# EAGLE design PCEmon_PLUS_rev_C (EAGLE 9.4.0)
PC Engine Joypad Breakout Version 1.0
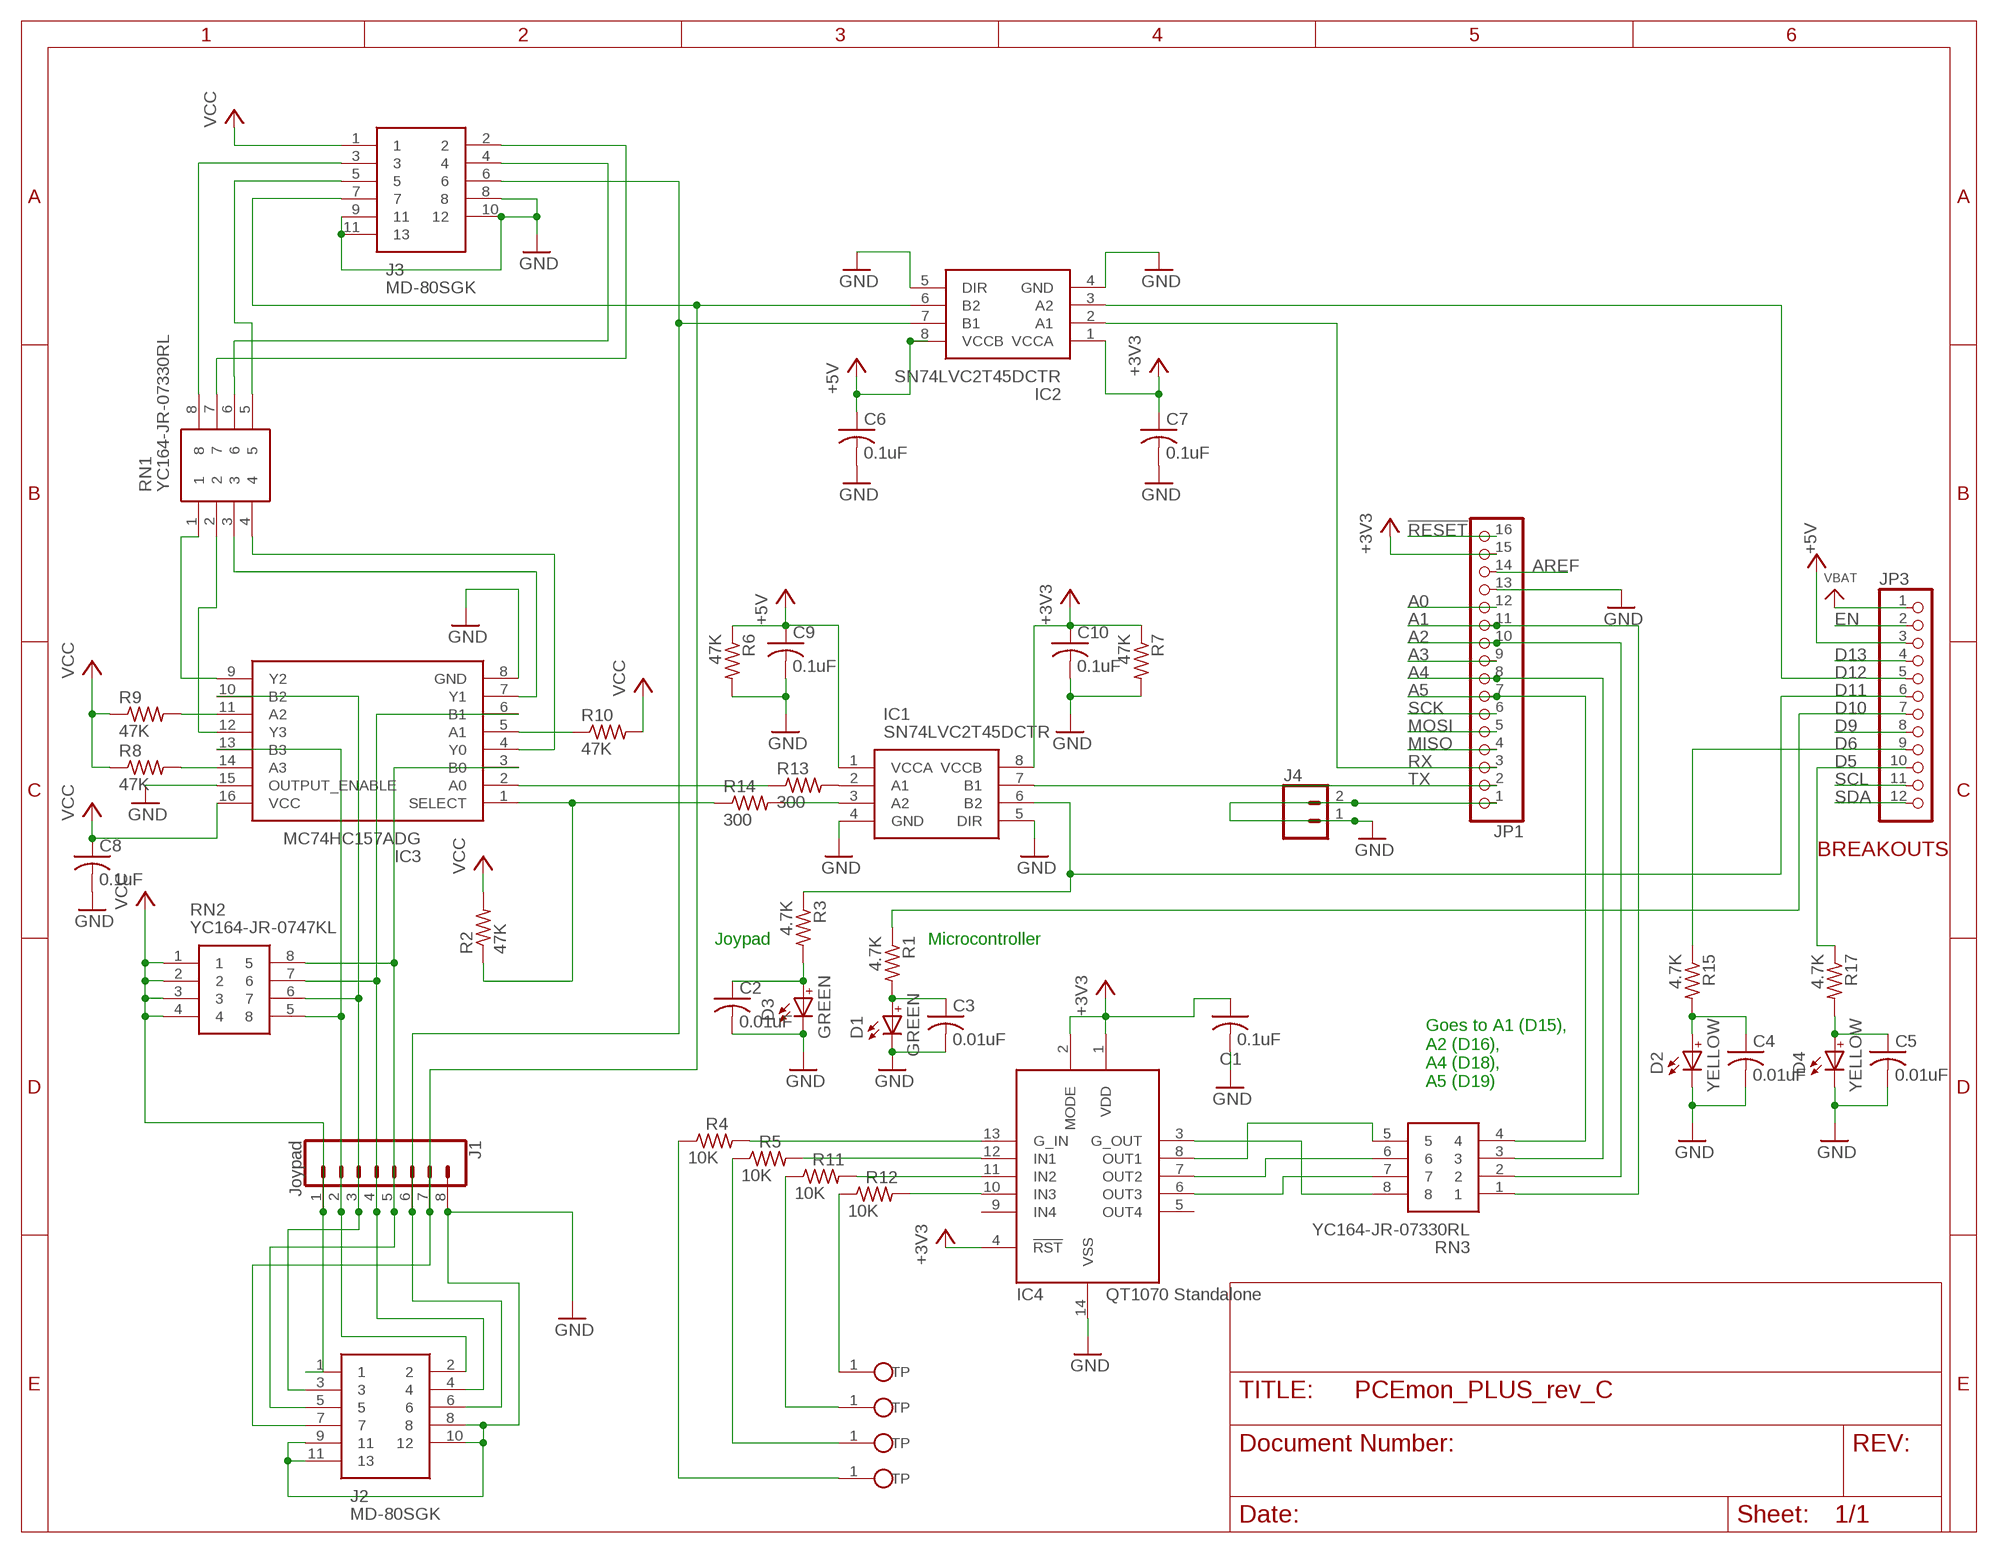
[diagram p0: schematic, sheet 1]

## Parts
C1  0.1uF  C-USC0603  [C0603]
C2  0.01uF  C-USC0603  [C0603]
C3  0.01uF  C-USC0603  [C0603]
C4  0.01uF  C-USC0603  [C0603]
C5  0.01uF  C-USC0603  [C0603]
C6  0.1uF  C-USC0603  [C0603]
C7  0.1uF  C-USC0603  [C0603]
C8  0.1uF  C-USC0603  [C0603]
C9  0.1uF  C-USC0603  [C0603]
C10  0.1uF  C-USC0603  [C0603]
D1  GREEN  WL-SMCC_0603_R/V/Y_150060RS73220  [WL-SMCC_0603_R/Y/V]
D2  YELLOW  WL-SMCC_0603_R/V/Y_150060RS73220  [WL-SMCC_0603_R/Y/V]
D3  GREEN  WL-SMCC_0603_R/V/Y_150060RS73220  [WL-SMCC_0603_R/Y/V]
D4  YELLOW  WL-SMCC_0603_R/V/Y_150060RS73220  [WL-SMCC_0603_R/Y/V]
IC1  SN74LVC2T45DCTR  [SOP65P400X130-8N]
IC2  SN74LVC2T45DCTR  [SOP65P400X130-8N]
IC3  MC74HC157ADG  [SOIC127P600X175-16N]
IC4  AT42QT1070-SSU  [SO14]
J1  Joypad  CONN_08"  [1X08]
J2  MD-80SGK  [MD80SGK]
J3  MD-80SGK  [MD80SGK]
J4  CONN_021X02_NO_SILK  [1X02_NO_SILK]
JP1  HEADER-1X16ROUND  [1X16_ROUND]
JP3  HEADER-1X12  [1X12_ROUND]
P1  JOYPAD  TOUCHPAD-350X500  [TOUCH-350X500]
P2  COMPUTER  TOUCHPAD-350X500  [TOUCH-350X500]
P3  Original Mode  TOUCHPAD-350X500  [TOUCH-350X500]
P4  PLUS Mode  TOUCHPAD-350X500  [TOUCH-350X500]
R1  4.7K  R-US_R0603  [R0603]
R2  47K  R-US_R0603  [R0603]
R3  4.7K  R-US_R0603  [R0603]
R4  10K  R-US_R0603  [R0603]
R5  10K  R-US_R0603  [R0603]
R6  47K  R-US_R0603  [R0603]
R7  47K  R-US_R0603  [R0603]
R8  47K  R-US_R0603  [R0603]
R9  47K  R-US_R0603  [R0603]
R10  47K  R-US_R0603  [R0603]
R11  10K  R-US_R0603  [R0603]
R12  10K  R-US_R0603  [R0603]
R13  300  R-US_R0603  [R0603]
R14  300  R-US_R0603  [R0603]
R15  4.7K  R-US_R0603  [R0603]
R17  4.7K  R-US_R0603  [R0603]
RN1  YC164-JR-07330RL  [YC164JR07220RL]
RN2  YC164-JR-0747KL  [YC164JR07220RL]
RN3  YC164-JR-07330RL  [YC164JR07220RL]

## Nets
!RESET: JP1.16
+3V3 [power]: C1.1 C7.1 C10.1 IC1.8(VCCB) IC2.1(VCCA) IC4.1(VDD) IC4.2(MODE) IC4.4(!RST) JP1.15 R7.1
+5V [power]: C6.1 C9.1 IC1.1(VCCA) IC2.8(VCCB) JP3.3 R6.1
A0: JP1.12
A1: JP1.11 RN3.1
A2: JP1.10 RN3.2
A3: JP1.9
A4: JP1.8 RN3.3
A5: JP1.7 RN3.4
AREF: JP1.14
D5 [signal]: JP3.10 R17.1
D6 [signal]: JP3.9 R15.1
D9: JP3.8
D10 [signal]: JP3.7 R1.1
D11 [signal]: IC1.6(B2) JP3.6 R3.1
D12 [signal]: IC2.3(A2) JP3.5
D13 [signal]: JP3.4
EN: JP3.2
GND: C1.2 C2.2 C3.2 C4.2 C5.2 C6.2 C7.2 C8.2 C9.2 C10.2 D1.1(C) D2.1(C) D3.1(C) D4.1(C) IC1.4(GND) IC1.5(DIR) IC2.4(GND) IC2.5(DIR) IC3.8(GND) IC3.15(OUTPUT_ENABLE) IC4.14(VSS) J1.8 J2.8 J2.9 J2.10 J2.11 J3.8 J3.9 J3.10 J3.11 J4.1 J4.2 JP1.1 JP1.13 R6.2 R7.2
MISO: JP1.4
MOSI: JP1.5
N$1: C2.1 D3.2(A) R3.2
N$2 [signal]: IC3.10(B2) J1.3 J2.3 RN2.6
N$3 [signal]: IC3.13(B3) J1.2 J2.2 RN2.5
N$4 [signal]: IC3.6(B1) J1.4 J2.4 RN2.7
N$5 [signal]: IC3.3(B0) J1.5 J2.5 RN2.8
N$6 [signal]: IC2.7(B1) J1.6 J2.6 J3.6
N$7 [signal]: IC2.6(B2) J1.7 J2.7 J3.7
N$8: J3.5 RN1.5
N$9: C3.1 D1.2(A) R1.2
N$10: J3.4 RN1.6
N$11: J3.3 RN1.8
N$12: IC3.14(A3) R8.2
N$13: IC3.11(A2) R9.2
N$14: IC3.1(SELECT) R2.1 R14.1
N$15: IC1.2(A1) R13.2
N$16: IC3.5(A1) R10.1
N$17: IC3.9(Y2) RN1.1
N$18: IC3.2(A0) R13.1
N$19: IC1.3(A2) R14.2
N$20: IC3.12(Y3) RN1.2
N$21: IC4.13(G_IN) R4.2
N$22: IC3.4(Y0) RN1.4
N$23: J3.2 RN1.7
N$24: IC3.7(Y1) RN1.3
N$25: IC4.12(IN1) R5.2
N$26: IC4.11(IN2) R11.2
N$27: IC4.10(IN3) R12.2
N$28: IC4.3(G_OUT) RN3.8
N$29: IC4.6(OUT3) RN3.7
N$30: IC4.7(OUT2) RN3.6
N$31: IC4.8(OUT1) RN3.5
N$32: P3.1(TP) R5.1
N$33: P4.1(TP) R4.1
N$34: P2.1(TP) R11.1
N$35: P1.1(TP) R12.1
N$36: C4.1 D2.2(A) R15.2
N$38: C5.1 D4.2(A) R17.2
RX: IC2.2(A1) JP1.3
SCK: JP1.6
SCL: JP3.11
SDA: JP3.12
TX: IC1.7(B1) JP1.2
VBAT: JP3.1
VCC [power]: C8.1 IC3.16(VCC) J1.1 J2.1 J3.1 R2.2 R8.1 R9.1 R10.2 RN2.1 RN2.2 RN2.3 RN2.4
Unconnected: IC4.5(OUT4) IC4.9(IN4)

## Notes on the sheet
- BREAKOUTS
- Joypad | Microcontroller
- Goes to A1 (D15),
  A2 (D16),
  A4 (D18),
  A5 (D19)

## Library data of the parts
C1-C10 = resistor:C-US: CAPACITOR, American symbol
D1-D4 = Wurth_Elektronik_Optoelectronics_rev19a:WL-SMCC_0603_R/V/Y: WL-SMCC SMD Mono-color Chip LED Compact Characteristics Compatible to IR reflow soldering Miniaturized color effect Size 0603 Industrial platform – 1.6 x 0.8 mm Ultra thin 0.2 mm PCB based Temperature Tj = 115°C / 125°C Applications Size 0603 Office Automation Home appliances Industrial equipment Industrial switches and button backlighting Dashboards Entertainment consoles Small pixel indoor signs <http://katalog.we-online.de/media/images/v2/Family_WL-SMCC_neu.jpg> Details see: http://katalog.we-online.de/en/led/WL-SMCC?m Created By Yingchun Shan 2018-03-09 2018 (C) Wurth Elektronik
IC1 IC2 = SamacSys_Parts:SN74LVC2T45DCTR: 2-Bit Bus Transceiver, Translation SSOP8 SN74LVC2T45DCTR, Voltage Level Translator, Bus Transceiver LVC, 3-State 1.65 Source: Datasheet <http://www.ti.com/lit/ds/symlink/sn74lvc2t45.pdf>; DESCRIPTION: 2-Bit Bus Transceiver, Translation SSOP8 SN74LVC2T45DCTR, Voltage Level Translator, Bus Transceiver LVC, 3-State 1.65; HEIGHT: 1.3mm; MANUFACTURER_NAME: Texas Instruments; MANUFACTURER_PART_NUMBER: SN74LVC2T45DCTR; MOUSER_PART_NUMBER: 595-SN74LVC2T45DCTR; MOUSER_PRICE-STOCK: https://www.mouser.com/Search/Refine.aspx?Keyword=595-SN74LVC2T45DCTR; RS_PART_NUMBER: 9213022; RS_PRICE-STOCK: http://uk.rs-online.com/web/p/products/9213022
IC3 = PC-Engine:MC74HC157ADG: Source: Datasheet <http://www.onsemi.com/pub/Collateral/MC74HC157A-D.PDF>; ALLIED_NUMBER: 70466365; ALLIED_PRICE-STOCK: http://www.alliedelec.com/on-semiconductor-mc74hc157adg/70466365/; HEIGHT: 1.75mm; MANUFACTURER_NAME: ON Semiconductor; MANUFACTURER_PART_NUMBER: MC74HC157ADG; MOUSER_PART_NUMBER: 863-MC74HC157ADG; MOUSER_PRICE-STOCK: https://www.mouser.com/Search/Refine.aspx?Keyword=863-MC74HC157ADG; RS_PART_NUMBER: 8061422P; RS_PRICE-STOCK: http://uk.rs-online.com/web/p/products/8061422P
IC4 = adafruit:AT42QT1070: QTouch 5-channel standalone sensor IC AT42QT1070 in standalone mode has 5 inputs (guard + 4 key) and open drain outputs. 1.8V-5.5V power.
J1 = SparkFun-Connectors:CONN_08: Multi connection point. Often used as Generic Header-pin footprint for 0.1 inch spaced/style header connections On any of the 0.1 inch spaced packages, you can populate with these: Break Away Headers - Straight <https://www.sparkfun.com/products/116> (PRT-00116) Break Away Male Headers - Right Angle <https://www.sparkfun.com/products/553> (PRT-00553) Female Headers <https://www.sparkfun.com/products/115> (PRT-00115) Break Away Headers - Machine Pin <https://www.sparkfun.com/products/117> (PRT-00117) Break Away Female Headers - Swiss Machine Pin <https://www.sparkfun.com/products/743> (PRT-00743) Arduino Stackable Header - 8 Pin <https://www.sparkfun.com/products/9279> (PRT-09279) For SCREWTERMINALS and SPRING TERMINALS visit here: Screw Terimnals on SparkFun.com <https://www.sparkfun.com/search/results?term=Screw+Terminals> (5mm/3.5mm/2.54mm spacing) This device is also useful as a general connection point to wire up your design to another part of your project. Our various solder wires solder well into these plated through hole pads. Hook-Up Wire - Assortment (Stranded, 22 AWG) <https://www.sparkfun.com/products/11375> (PRT-11375) Hook-Up Wire - Assortment (Solid Core, 22 AWG) <https://www.sparkfun.com/products/11367> (PRT-11367) View the entire wire category on our website here <https://www.sparkfun.com/categories/141> Special notes: Molex polarized connector foot print use with SKU : PRT-08231 with associated crimp pins and housings. 1MM SMD Version SKU: PRT-10208 NOTES ON THE VARIANTS LOCK and LOCK_LONGPADS... This footprint was designed to help hold the alignment of a through-hole component (i.e. 6-pin header) while soldering it into place. You may notice that each hole has been shifted either up or down by 0.005 of an inch from it's more standard position (which is a perfectly straight line). This slight alteration caused the pins (the squares in the middle) to touch the edges of the holes. Because they are alternating, it causes a "brace" to hold the component in place. 0.005 has proven to be the perfect amount of "off-center" position when using our standard breakaway headers. Although looks a little odd when you look at the bare footprint, once you have a header in there, the alteration is very hard to notice. Also,if you push a header all the way into place, it is covered up entirely on the bottom side.; PROD_ID: CONN-08438
J2 J3 = SamacSys_Parts:MD-80SGK: Circular DIN Connectors mini-DIN, 8P jack, rt, through hole, full shield Source: Datasheet <https://www.cui.com/product/resource/md-sgk-series.pdf>; DESCRIPTION: Circular DIN Connectors mini-DIN, 8P jack, rt, through hole, full shield; HEIGHT: 13mm; MANUFACTURER_NAME: CUI; MANUFACTURER_PART_NUMBER: MD-80SGK; MOUSER_PART_NUMBER: 490-MD-80SGK; MOUSER_PRICE-STOCK: https://www.mouser.com/Search/Refine.aspx?Keyword=490-MD-80SGK
J4 = SparkFun-Connectors:CONN_02: Multi connection point. Often used as Generic Header-pin footprint for 0.1 inch spaced/style header connections On any of the 0.1 inch spaced packages, you can populate with these: Break Away Headers - Straight <https://www.sparkfun.com/products/116> (PRT-00116) Break Away Male Headers - Right Angle <https://www.sparkfun.com/products/553> (PRT-00553) Female Headers <https://www.sparkfun.com/products/115> (PRT-00115) Break Away Headers - Machine Pin <https://www.sparkfun.com/products/117> (PRT-00117) Break Away Female Headers - Swiss Machine Pin <https://www.sparkfun.com/products/743> (PRT-00743) For SCREWTERMINALS and SPRING TERMINALS visit here: Screw Terimnals on SparkFun.com <https://www.sparkfun.com/search/results?term=Screw+Terminals> (5mm/3.5mm/2.54mm spacing) This device is also useful as a general connection point to wire up your design to another part of your project. Our various solder wires solder well into these plated through hole pads. Hook-Up Wire - Assortment (Stranded, 22 AWG) <https://www.sparkfun.com/products/11375> (PRT-11375) Hook-Up Wire - Assortment (Solid Core, 22 AWG) <https://www.sparkfun.com/products/11367> (PRT-11367) View the entire wire category on our website here <https://www.sparkfun.com/categories/141> Special notes: Molex polarized connector foot print use with: PRT-08233 with associated crimp pins and housings. 2.54_SCREWTERM for use with PRT-10571. 3.5mm Screw Terminal footprints for PRT-08084 5mm Screw Terminal footprints for use with PRT-08432
JP1 = microbuilder:HEADER-1X16: PIN HEADER
JP3 = microbuilder:HEADER-1X12
P1-P4 = SamacSys_Parts:TOUCHPAD-350X500
R1-R15 R17 = resistor:R-US_: RESISTOR, American symbol
RN1 RN3 = SamacSys_Parts:YC164-JR-07330RL: YAGEO - YC164-JR-07330RL - RESISTOR ARRAY, ARV241 1206 330R Source: Datasheet <https://media.digikey.com/pdf/Data Sheets/Yageo PDFs/YC102-358,TC122-164_Series_DS.pdf>; DESCRIPTION: YAGEO - YC164-JR-07330RL - RESISTOR ARRAY, ARV241 1206 330R; HEIGHT: 0mm; MANUFACTURER_NAME: YAGEO (PHYCOMP); MANUFACTURER_PART_NUMBER: YC164-JR-07330RL; MOUSER_PART_NUMBER: 603-YC164-JR-07330RL; MOUSER_PRICE-STOCK: https://www.mouser.com/Search/Refine.aspx?Keyword=603-YC164-JR-07330RL
RN2 = SamacSys_Parts:YC164-JR-0747KL: YAGEO - YC164-JR-0747KL - RESISTOR ARRAY, ARV241 1206 47K Source: Datasheet <https://media.digikey.com/pdf/Data Sheets/Yageo PDFs/YC102-358,TC122-164_Series_DS.pdf>; DESCRIPTION: YAGEO - YC164-JR-0747KL - RESISTOR ARRAY, ARV241 1206 47K; HEIGHT: 0mm; MANUFACTURER_NAME: YAGEO (PHYCOMP); MANUFACTURER_PART_NUMBER: YC164-JR-0747KL; MOUSER_PART_NUMBER: 603-YC164-JR-0747KL; MOUSER_PRICE-STOCK: https://www.mouser.com/Search/Refine.aspx?Keyword=603-YC164-JR-0747KL

## Net classes
0 default: width 0.152 mm, drill 0.356 mm, clearance 0.152 mm
1 power: width 0.305 mm, drill 0.356 mm, clearance 0.152 mm
2 signal: width 0.152 mm, drill 0.356 mm, clearance 0.152 mm

## Board
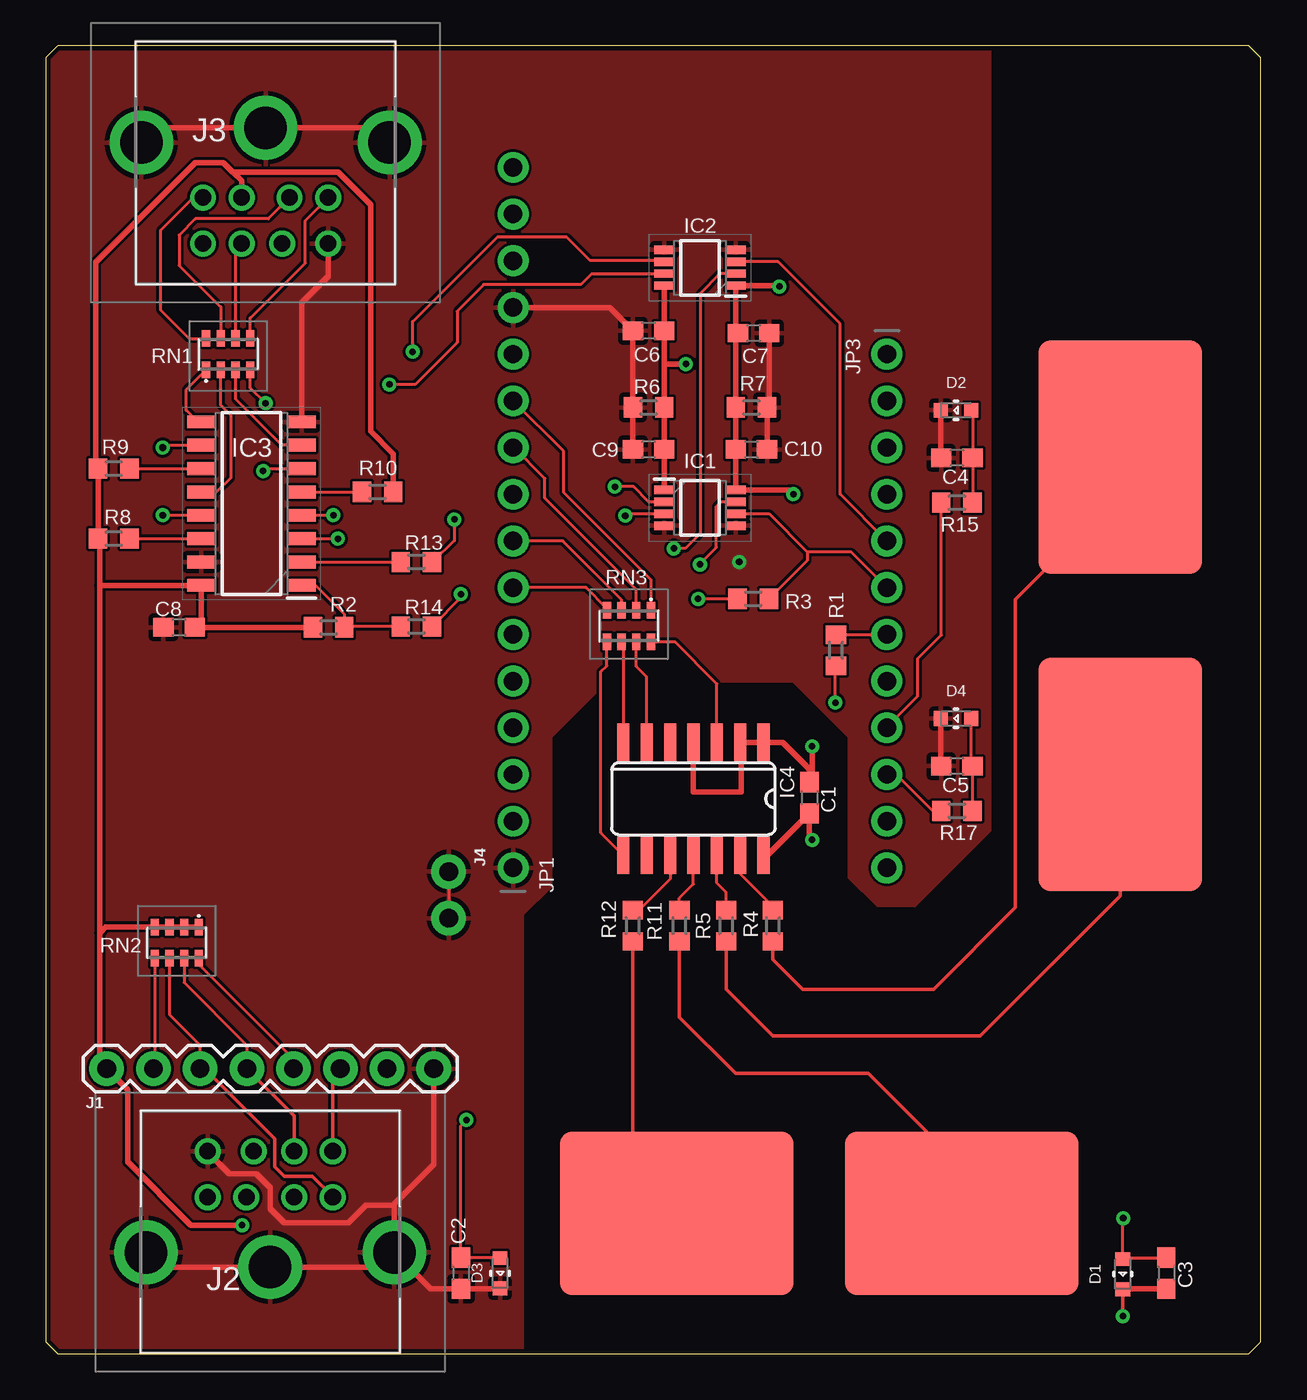
[diagram p1: board, top side]
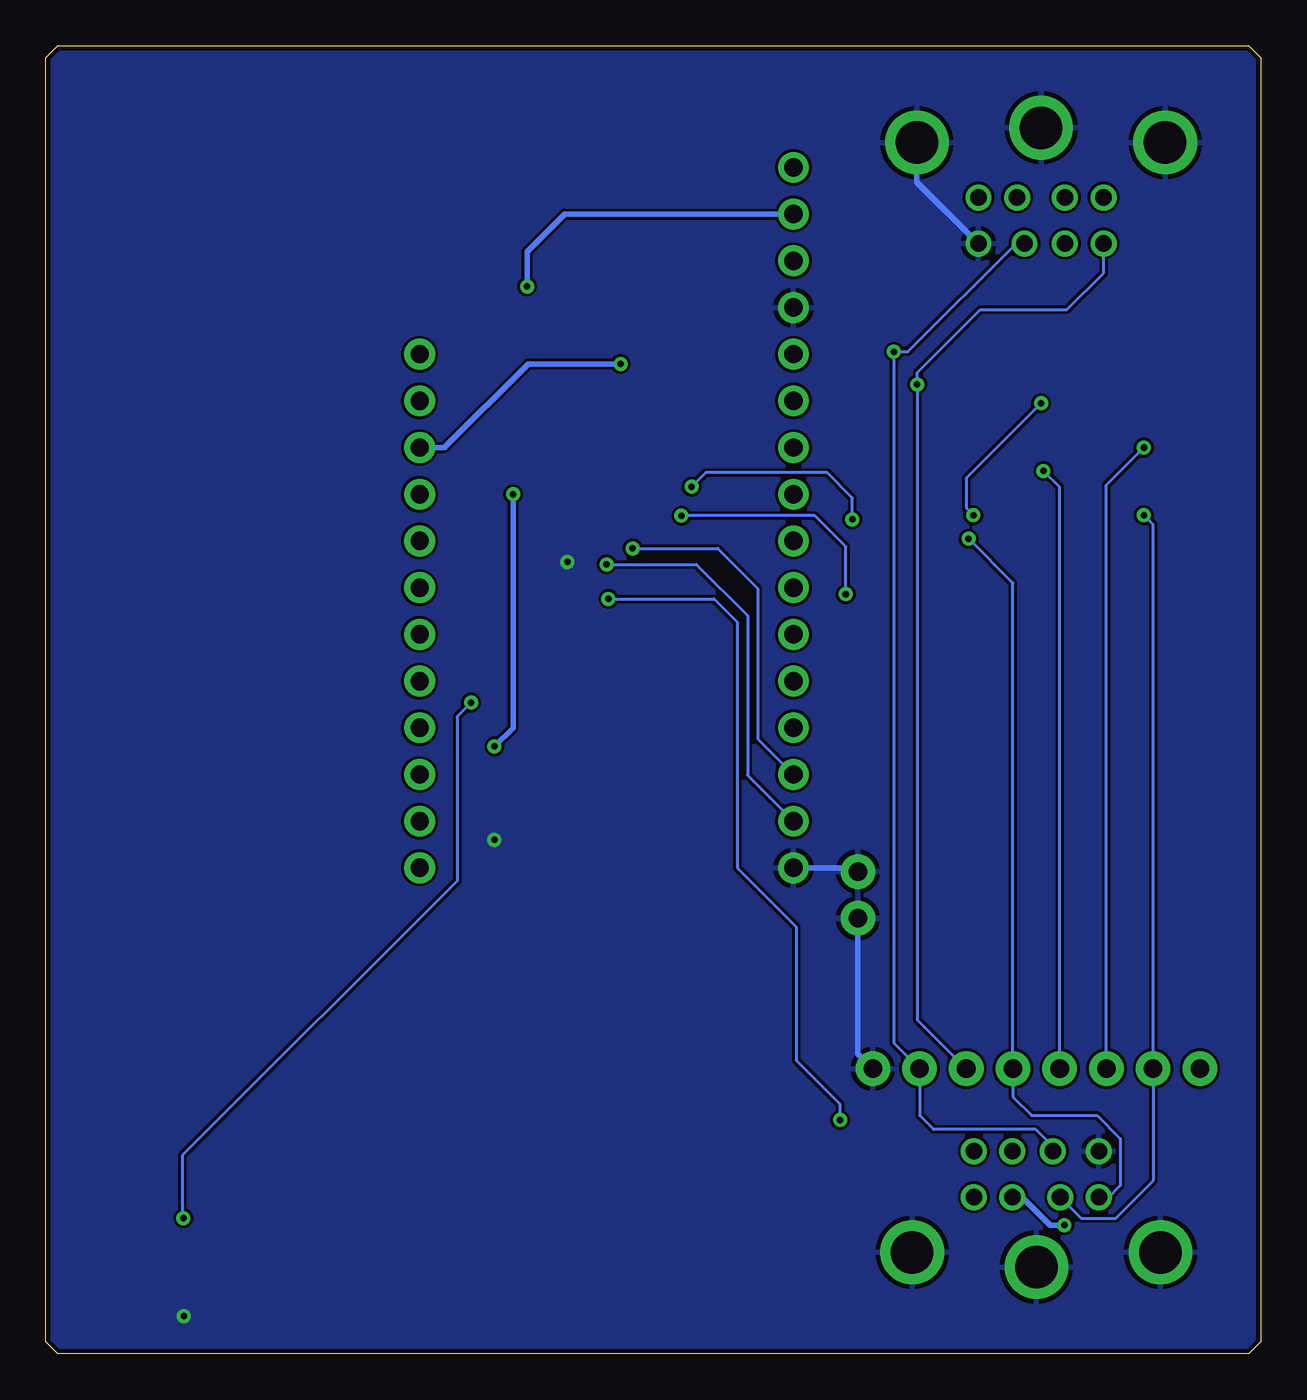
[diagram p2: board, bottom side, seen from below]

Size 66.04 x 71.12 mm. Coordinates in mm from the lower left corner, seen from the top.
Outline: 0.64,0 65.41,0 66.04,0.64 66.04,70.48 65.41,71.12 0.64,71.12 0,70.48 0,0.64 0.64,0
Copper layers (1*16): Top 0.035mm / dielectric 1.5mm / Bottom 0.035mm
Design rules "default *": minimum track width 6mil, minimum drill 0.35mm, track to track 6mil, track to pad 6mil, pad to pad 6mil, via to via 6mil, smd to smd 6mil, copper to edge 10mil, drill to drill 6mil, minimum pad ring 10mil, minimum via ring 8mil, stop-mask expansion 6mil, vias tented up to drill 15mil, thermal gap 10mil

### Footprints (pad centres in the part's own frame; a part is rotated, then mirrored left to right if it is on the bottom)
C0603 = smd 1.1 x 1: 1 -0.85,0; 2 0.85,0
WL-SMCC_0603_R/Y/V = smd 0.75 x 0.8: 1 -0.825,0; 2 0.825,0
SOP65P400X130-8N = smd 1.1 x 0.45: 1 -1.95,0.975; 2 -1.95,0.325; 3 -1.95,-0.325; 4 -1.95,-0.975; 5 1.95,-0.975; 6 1.95,-0.325; 7 1.95,0.325; 8 1.95,0.975
SOIC127P600X175-16N = smd 1.55 x 0.7: 1 -2.725,4.445; 2 -2.725,3.175; 3 -2.725,1.905; 4 -2.725,0.635; 5 -2.725,-0.635; 6 -2.725,-1.905; 7 -2.725,-3.175; 8 -2.725,-4.445; 9 2.725,-4.445; 10 2.725,-3.175; 11 2.725,-1.905; 12 2.725,-0.635; 13 2.725,0.635; 14 2.725,1.905; 15 2.725,3.175; 16 2.725,4.445
SO14 = smd 0.66 x 2.032: 1 -3.81,-3.073; 2 -2.54,-3.073; 3 -1.27,-3.073; 4 0,-3.073; 5 1.27,-3.073; 6 2.54,-3.073; 7 3.81,-3.073; 8 3.81,3.073; 9 2.54,3.073; 10 1.27,3.073; 11 0,3.073; 12 -1.27,3.073; 13 -2.54,3.073; 14 -3.81,3.073
1X08 = drill 1.016 pad 1.88: 1 0,0; 2 2.54,0; 3 5.08,0; 4 7.62,0; 5 10.16,0; 6 12.7,0; 7 15.24,0; 8 17.78,0
MD80SGK = drill 0.9 pad 1.4: 1 -1.3,-1.9; 2 1.3,-1.9; 3 -3.4,-1.9; 4 -1.3,-4.4; 5 3.4,-1.9; 6 -3.4,-4.4; 7 0.9,-4.4; 8 3.4,-4.4 | drill 2.309 pad 3.463: 9 0,1.9; 10 -6.75,1.1; 11 6.75,1.1
1X02_NO_SILK = drill 1.016 pad 1.88: 1 0,0; 2 2.54,0
1X16_ROUND = drill 1 pad 1.676: 1 -19.05,0; 2 -16.51,0; 3 -13.97,0; 4 -11.43,0; 5 -8.89,0; 6 -6.35,0; 7 -3.81,0; 8 -1.27,0; 9 1.27,0; 10 3.81,0; 11 6.35,0; 12 8.89,0; 13 11.43,0; 14 13.97,0; 15 16.51,0; 16 19.05,0
1X12_ROUND = drill 1 pad 1.676: 1 -13.97,0; 2 -11.43,0; 3 -8.89,0; 4 -6.35,0; 5 -3.81,0; 6 -1.27,0; 7 1.27,0; 8 3.81,0; 9 6.35,0; 10 8.89,0; 11 11.43,0; 12 13.97,0
TOUCH-350X500 = smd 12.7 x 8.89: 1 0,0
R0603 = smd 1 x 1.1: 1 -0.85,0; 2 0.85,0
YC164JR07220RL = smd 0.45 x 0.9: 1 -1.2,-0.85; 2 -0.4,-0.85; 3 0.4,-0.85; 4 1.2,-0.85; 5 1.2,0.85; 6 0.4,0.85; 7 -0.4,0.85; 8 -1.2,0.85

### Placement (x,y rotation side)
C1  41.5,30.23 270 top
C2  22.56,4.37 270 top
C3  60.91,4.37 270 top
C4  49.53,48.72 180 top
C5  49.53,31.95 180 top
C6  32.77,55.63 180 top
C7  38.48,55.5 0 top
C8  7.24,39.5 180 top
C9  32.77,49.17 180 top
C10  38.35,49.17 0 top
D1  58.55,4.32 90 top
D2  49.48,51.31 0 top
D3  24.69,4.37 90 top
D4  49.48,34.54 0 top
IC1  35.56,46 0 top
IC2  35.56,59.05 180 top
IC3  11.18,46.23 180 top
IC4  35.2,30.18 180 top
J1  3.3,15.49 0 top
J2  12.19,6.6 180 top
J3  11.94,64.77 0 top
J4  21.89,26.21 270 top
JP1  25.4,45.47 90 top
JP3  45.72,40.39 270 top
P1  34.29,7.62 0 top
P2  49.78,7.62 0 top
P3  58.42,31.5 90 top
P4  58.42,48.77 90 top
R1  42.95,38.25 270 top
R2  15.37,39.5 180 top
R3  38.46,41.05 180 top
R4  39.52,23.27 90 top
R5  36.98,23.27 90 top
R6  32.77,51.46 180 top
R7  38.35,51.46 0 top
R8  3.68,44.32 0 top
R9  3.68,48.13 0 top
R10  18.03,46.86 0 top
R11  34.44,23.27 90 top
R12  31.9,23.27 90 top
R13  20.14,43.05 0 top
R14  20.14,39.55 0 top
R15  49.53,46.28 0 top
R17  49.53,29.51 0 top
RN1  9.91,54.36 0 top
RN2  7.11,22.35 180 top
RN3  31.7,39.57 180 top

### Tracks (layer width: path | path; a pad name or v marks a point on that pad's centre or on a via)
+3V3  (via drill 0.36)
  Top 0.305: v39.88,58.04 39.84,58.08 IC2.1 37.51,55.62 C7.1 37.5,55.37 R7.1 C10.1 IC1.8 40.4,46.97 v40.64,46.74 | IC4.4 35.2,30.53 37.8,30.53 37.8,33.2 IC4.2 IC4.1 40.06,33.25 41.5,31.8 C1.1 41.66,31.23 v41.66,33.02
  Bottom 0.305: JP1.15 37.85,61.98 39.88,59.94 v39.88,58.04 | v41.66,33.02 40.64,34.04 v40.64,46.74
+5V  (via drill 0.36)
  Top 0.305: IC1.1 C9.1 R6.1 33.62,53.82 | 33.62,53.82 C6.1 IC2.8 | v34.8,53.82 33.62,53.82
  Bottom 0.305: JP3.3 44.37,49.28 39.83,53.82 v34.8,53.82
A1
  Top 0.152: JP1.11 28.14,49.07 28.14,46.84 32.9,42.08 RN3.1
A2
  Top 0.152: JP1.10 25.45,49.28 27.13,47.6 27.13,46.53 32.1,41.56 RN3.2
A4
  Top 0.152: RN3.3 31.3,41 28.1,44.2 JP1.8
A5
  Top 0.152: RN3.4 30.5,40.52 29.36,41.66 JP1.7
D5
  Top 0.152: R17.1 48.21,29.52 46.23,31.5 JP3.10
D6
  Top 0.152: R15.1 48.68,39.08 47.4,37.8 47.4,35.76 45.72,34.09 JP3.9
D10
  Top 0.152: R1.1 45.25,39.1 45.26,39.12 JP3.7
D11
  Top 0.152: IC1.6 39.31,45.67 41.4,43.59 | JP3.6 43.79,43.59 41.4,43.59 | 41.4,43.59 41.4,43.14 R3.1
D12
  Top 0.152: IC2.3 39.81,59.38 43.18,56.01 43.18,46.74 JP3.5
GND  (via drill 0.36)
  Top 0.152: J4.1 J4.2
  Top 0.203: v58.55,2.03 D1.1
  Top 0.305: 18.86,8.06 18.92,8.06 18.92,5.52 J2.10 | 18.86,8.06 17.4,8.06 16.45,7.11 12.95,7.11 12.19,7.87 12.19,9.02 11.43,9.78 9.97,9.78 9.02,10.73 J2.8 | C10.2 R7.2 39.33,51.59 C7.2 | C9.2 R6.2 C6.2 30.65,56.9 JP1.13 | J2.11 6.24,4.7 J2.9 18.14,4.7 J2.10 | J1.8 21.08,10.29 18.86,8.06 | J3.10 5.99,66.67 J3.9 17.89,66.67 J3.11 | IC3.8 13.9,57.16 15.34,58.6 J3.8 | IC4.14 39.23,27.1 C1.2 41.5,28.09 v41.66,27.94 | J2.10 20.93,3.52 C2.2 24.66,3.52 D3.1 | D1.1 58.57,3.52 C3.2 | C5.2 48.65,31.98 D4.1 | C4.2 48.65,48.74 D2.1
  Bottom 0.305: J3.8 18.69,63.72 J3.11 | J4.2 21.89,16.31 J1.8 | J4.1 22.1,26.42 JP1.1
  other vias: 37.69,43.05
  pour Bottom: -0.38,71.88 67.06,71.88 67.06,-0.38 -0.38,-0.38
  pour Top: -0.51,-0.51 -0.51,71.63 51.31,71.63 51.31,28.45 47.24,24.38 45.21,24.38 43.69,25.91 43.69,33.53 40.64,36.58 30.48,36.58 27.43,33.53 27.43,25.4 25.91,23.88 25.91,-0.51
N$1  (via drill 0.36)
  Top 0.152: R3.2 v35.46,41.05 | D3.2 22.58,5.19 C2.1 22.55,12.39 v22.86,12.7
  Bottom 0.152: v35.46,41.05 29.72,41.05 28.45,39.78 28.45,26.42 25.25,23.22 25.25,15.95 22.86,13.56 v22.86,12.7
N$2  (via drill 0.36)
  Top 0.152: v6.35,49.28 6.48,49.4 IC3.10 | RN2.6 6.71,18.43 8.38,16.76 J1.3
  Top 0.203: J1.3 8.64,15.49 12.45,11.68 12.45,10.16 12.95,9.65 14.48,9.65 15.59,8.54 J2.3
  Bottom 0.152: J1.3 8.38,47.24 v6.35,49.28
N$3  (via drill 0.36)
  Top 0.152: v6.35,45.59 IC3.13 | RN2.5 5.91,15.91 5.84,15.84 J1.2
  Bottom 0.152: J2.2 9.75,7.37 7.87,7.37 5.84,9.4 J1.2 5.84,45.09 v6.35,45.59
N$4  (via drill 0.36)
  Top 0.152: v11.81,48.01 11.94,48.13 IC3.6 | RN2.7 7.51,20.17 10.92,16.76 J1.4
  Top 0.203: J2.4 13.49,12.92 J1.4
  Bottom 0.152: J1.4 10.92,47.12 v11.81,48.01
N$5  (via drill 0.36)
  Top 0.152: IC3.3 v15.88,44.32 | RN2.8 8.31,21.15 13.46,16 J1.5
  Bottom 0.152: J2.5 8.26,8.5 7.62,9.14 7.62,11.68 8.89,12.95 12.45,12.95 13.46,13.97 J1.5 13.46,41.91 v15.88,44.32
N$6  (via drill 0.36)
  Top 0.152: IC2.7 29.67,58.73 29.08,58.14 23.8,58.14 22.35,56.69 22.35,54.99 20.07,52.7 v18.67,52.7
  Top 0.203: J2.6 15.59,15.08 J1.6
  Bottom 0.152: J1.6 18.67,18.16 v18.67,52.7 18.67,53.34 15.24,56.77 10.54,56.77 8.54,58.77 J3.6
N$7  (via drill 0.36)
  Top 0.152: IC2.6 33.54,59.45 29.59,59.45 28.32,60.72 24.52,60.72 19.94,56.13 v19.94,54.48
  Bottom 0.152: J2.7 11.29,11.26 12.23,12.19 17.78,12.19 18.54,12.95 J1.7 19.94,16.89 v19.94,54.48 19.18,54.48 13.29,60.37 J3.7
N$8
  Top 0.152: J3.5 14.1,61.63 14.1,59.31 11.11,56.32 RN1.5
N$9  (via drill 0.36)
  Top 0.152: v42.93,35.41 42.93,37.38 R1.2 | v58.57,7.37 58.55,7.34 D1.2 58.62,5.22 C3.1
  Bottom 0.152: v42.93,35.41 43.69,34.65 43.69,25.7 58.62,10.77 58.62,7.42 v58.57,7.37
N$10
  Top 0.152: RN1.6 10.31,60.04 J3.4
N$11
  Top 0.152: J3.3 8.01,62.87 6.22,61.09 6.22,56.77 7.79,55.21 RN1.8
N$12
  Top 0.152: R8.2 IC3.14
N$13
  Top 0.152: R9.2 IC3.11
N$14
  Top 0.152: IC3.1 14.66,41.78 16.22,40.23 R2.1 16.27,39.55 R14.1
N$15  (via drill 0.36)
  Top 0.152: v22.2,45.36 22.2,44.21 R13.2 | IC1.2 32.77,46.32 31.95,47.14 v30.94,47.14
  Bottom 0.152: v22.2,45.36 22.2,46.53 23.57,47.9 30.18,47.9 v30.94,47.14
N$16
  Top 0.152: IC3.5 R10.1
N$17
  Top 0.152: IC3.9 8.26,50.67 7.62,51.31 7.62,52.42 RN1.1
N$18
  Top 0.152: IC3.2 R13.1
N$19  (via drill 0.36)
  Top 0.152: v22.55,41.3 22.55,41.11 R14.2 | v31.5,45.57 31.6,45.67 IC1.3
  Bottom 0.152: v22.55,41.3 22.55,43.89 24.23,45.57 v31.5,45.57
N$20
  Top 0.152: IC3.12 9.27,46.86 10.03,47.62 10.03,51.05 9.51,51.58 RN1.2
N$21
  Top 0.152: R4.2 39.52,24.32 37.74,26.1 IC4.13
N$22  (via drill 0.36)
  Top 0.152: IC3.4 v15.62,45.59 | v11.94,51.69 11.11,52.52 RN1.4
  Bottom 0.152: v15.62,45.59 16,45.97 16,47.62 v11.94,51.69
N$23
  Top 0.152: J3.2 12.09,61.72 8.13,61.72 7.24,60.83 7.24,59.18 9.51,56.91 RN1.7
N$24
  Top 0.152: IC3.7 12.83,49.4 10.31,51.92 RN1.3
N$25
  Top 0.152: R5.2 36.98,25.08 36.47,25.59 IC4.12
N$26
  Top 0.152: R11.2 34.44,24.78 35.2,25.54 IC4.11
N$27
  Top 0.152: IC4.10 33.93,25.81 32.24,24.12 R12.2
N$28
  Top 0.152: IC4.3 36.47,36.42 34.17,38.72 RN3.8
N$29
  Top 0.152: IC4.6 32.66,36.8 32.1,37.37 RN3.7
N$30
  Top 0.152: RN3.6 31.39,38.63 IC4.7
N$31
  Top 0.152: IC4.8 30.18,28.32 30.18,37.08 30.5,37.41 RN3.5
N$32
  Top 0.203: R5.1 36.98,19.81 39.52,17.27 50.8,17.27 58.42,24.89 P3.1
N$33
  Top 0.203: P4.1 58.42,46.74 52.7,41.02 52.7,24.26 48.26,19.81 41.15,19.81 39.52,21.44 R4.1
N$34
  Top 0.203: R11.1 34.44,18.29 37.49,15.24 44.7,15.24 49.78,10.16 P2.1
N$35
  Top 0.203: R12.1 31.9,11.79 34.29,9.4 P1.1
N$36
  Top 0.152: D2.2 50.38,51.23 C4.1 R15.2
N$38
  Top 0.152: R17.2 C5.1 50.3,32.03 D4.2
RX  (via drill 0.36)
  Top 0.152: IC2.2 36.63,58.73 35.56,57.66 35.56,44.6 34.75,43.79 v34.14,43.79
  Bottom 0.152: v34.14,43.79 29.52,43.79 27.33,41.6 27.33,33.43 JP1.3
TX  (via drill 0.36)
  Top 0.152: IC1.7 36.7,46.32 36.45,46.08 36.45,43.84 35.55,42.94 v35.56,42.93
  Bottom 0.152: v35.56,42.93 30.68,42.93 27.89,40.13 27.89,31.45 JP1.2
VCC  (via drill 0.36)
  Top 0.305: v10.67,6.99 7.87,6.99 4.45,10.41 4.45,14.35 J1.1 2.92,15.88 2.92,22.86 | 2.92,41.78 2.92,22.86 | 2.92,41.78 IC3.16 8.45,39.86 C8.1 R2.2 | 10.16,64.26 10.64,63.78 J3.1 | 10.16,64.26 9.65,64.77 8.13,64.77 2.71,59.35 2.71,48.26 R9.1 R8.1 2.92,44.23 2.92,41.78 | 10.16,64.26 15.88,64.26 17.65,62.49 17.65,50.16 18.88,48.93 R10.2 | RN2.1 RN2.2 RN2.3 RN2.4 3.26,23.2 2.92,22.86
  Bottom 0.305: v10.67,6.99 11.44,6.99 12.95,8.5 J2.1

### Text on the board
tValues: PCEmon PLUS, rev. C | (C)2020 David Shadoff | +5V | D0 | D1 | D2 | D3 | SEL | CLR | GND
bValues: JLCJLCJLCJLC